# EAGLE schematic boardv1 (EAGLE 7.4.0)
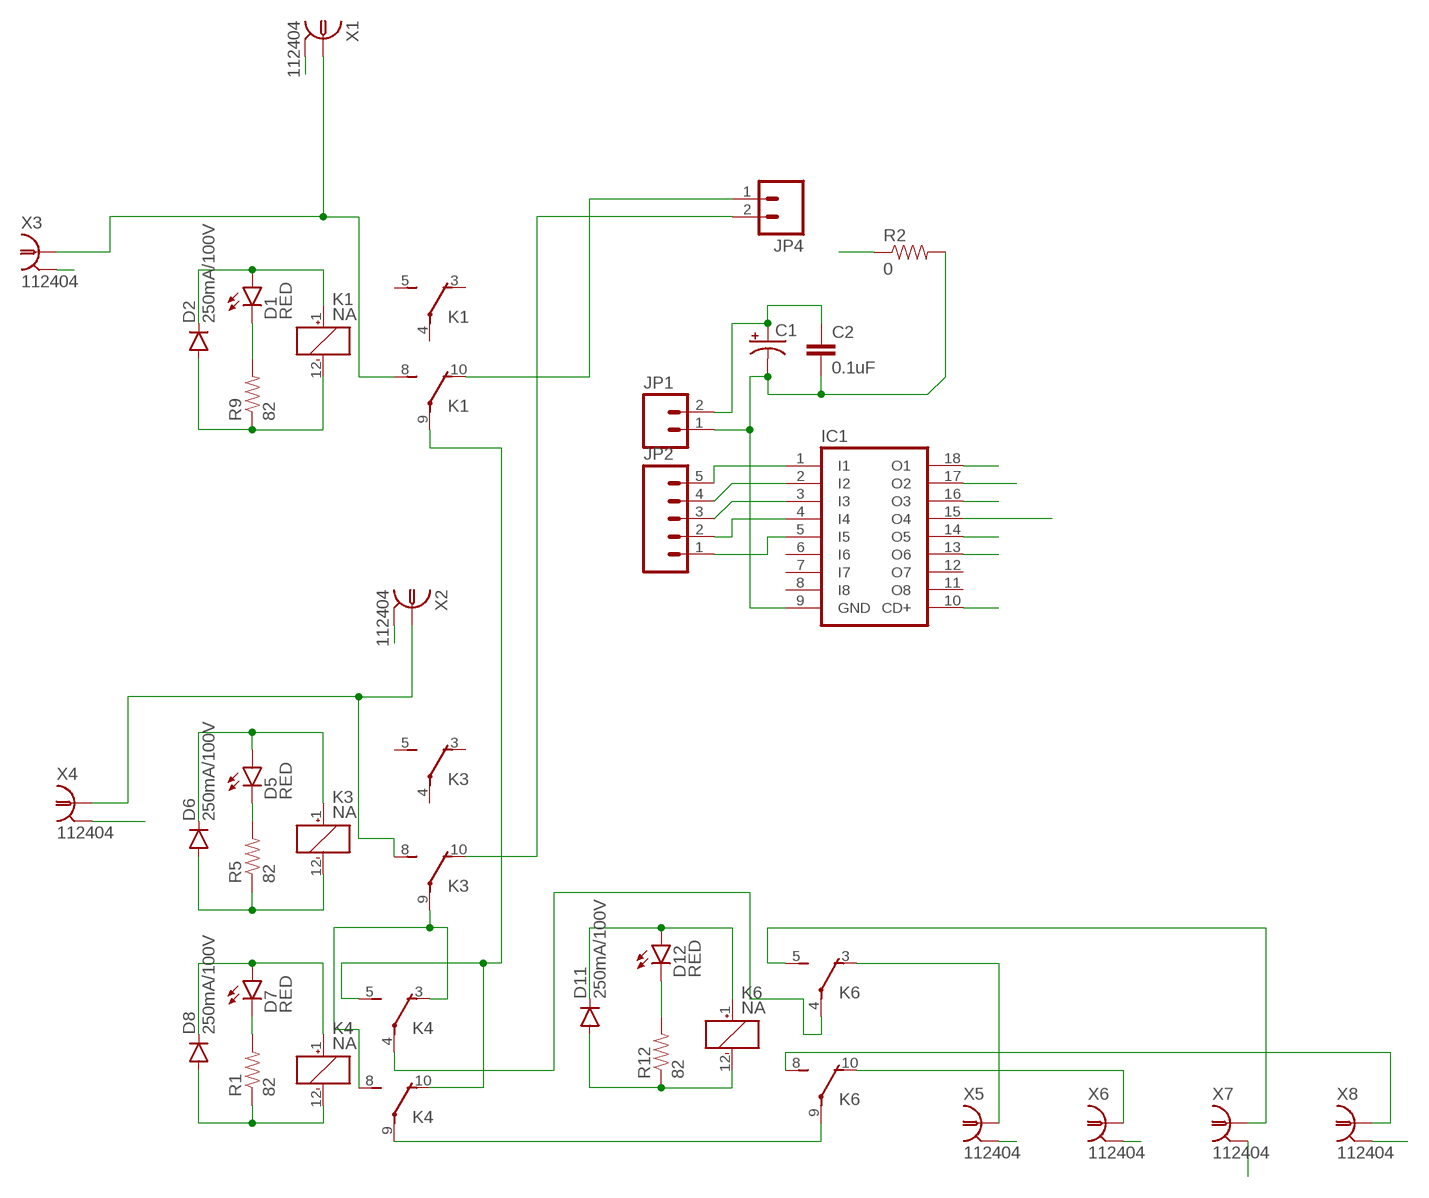
[diagram p0: schematic, sheet 1]

## Parts
C1  100UF-25V-20%(PTH)  [CPOL-RADIAL-100UF-25V]
C2  0.1uF  0.1UF-25V-5%(0603)  [0603-CAP]
D1  RED  LED-RED1206  [LED-1206]
D2  250mA/100V  DIODEBAS16  [SOD-323]
D5  RED  LED-RED1206  [LED-1206]
D6  250mA/100V  DIODEBAS16  [SOD-323]
D7  RED  LED-RED1206  [LED-1206]
D8  250mA/100V  DIODEBAS16  [SOD-323]
D11  250mA/100V  DIODEBAS16  [SOD-323]
D12  RED  LED-RED1206  [LED-1206]
IC1  ULN2803A  [DIL18]
JP1  M02PTH  [1X02]
JP2  M05PTH  [1X05]
JP4  M02PTH  [1X02]
K1  NA  [NA]
K3  NA  [NA]
K4  NA  [NA]
K6  NA  [NA]
R1  82  82OHM-1/10W-1%(0603)SMD  [0603-RES]
R2  0  0OHM-1/10W-5%(0603)  [0603]
R5  82  82OHM-1/10W-1%(0603)SMD  [0603-RES]
R9  82  82OHM-1/10W-1%(0603)SMD  [0603-RES]
R12  82  82OHM-1/10W-1%(0603)SMD  [0603-RES]
X1  112404  [112404]
X2  112404  [112404]
X3  112404  [112404]
X4  112404  [112404]
X5  112404  [112404]
X6  112404  [112404]
X7  112404  [112404]
X8  112404  [112404]

## Nets
ANALOG: K4.9(3:P) K6.9(3:P)
ARDUINO1: JP4.2 K3.10(3:O) K4.3(2:O)
DIGITAL: K4.4(2:P) K6.4(2:P)
GND: R2.1 X1.2 X1.3 X1.4 X1.5 X2.2 X2.3 X2.4 X2.5 X3.2 X3.3 X3.4 X3.5 X4.2 X4.3 X4.4 X4.5 X5.2 X5.3 X5.4 X5.5 X6.2 X6.3 X6.4 X6.5 X7.2 X7.3 X7.4 X7.5 X8.2 X8.3 X8.4 X8.5
GND2: C1.2(-) C2.2 IC1.9(GND) JP1.1 R2.2
N$1: JP4.1 K1.10(3:O)
N$3: D1.C R9.2
N$4: D12.C R12.2
N$5: D5.C R5.2
N$7: D7.C R1.2
N$21: IC1.1(I1) JP2.5
N$22: IC1.2(I2) JP2.4
N$23: IC1.3(I3) JP2.3
N$24: IC1.4(I4) JP2.2
N$25: IC1.5(I5) JP2.1
O1: K1.9(3:P) K4.5(2:S) K4.10(3:O)
O2: K3.8(3:S) X2.1 X4.1
OUTPUT1: K6.3(2:O) X5.1
OUTPUT2: K6.10(3:O) X6.1
OUTPUT4: K6.8(3:S) X8.1
OUTPUTA: K1.8(3:S) X1.1 X3.1
R1: D11.A IC1.18(O1) K6.12(1:-) R12.1
R2: D8.A IC1.17(O2) K4.12(1:-) R1.1
R3: D6.A IC1.16(O3) K3.12(1:-) R5.1
R4: D2.A IC1.15(O4) K1.12(1:-) R9.1
R5: IC1.14(O5)
R6: IC1.13(O6)
SIG3B: K3.9(3:P) K4.8(3:S)
SIG4A: K6.5(2:S) X7.1
VCC: C1.1(+) C2.1 D1.A D2.C D5.A D6.C D7.A D8.C D11.C D12.A IC1.10(CD+) JP1.2 K1.1(1:+) K3.1(1:+) K4.1(1:+) K6.1(1:+)
Unconnected: IC1.6(I6) IC1.7(I7) IC1.8(I8) IC1.11(O8) IC1.12(O7) K1.3(2:O) K1.4(2:P) K1.5(2:S) K3.3(2:O) K3.4(2:P) K3.5(2:S)

## Library data of the parts
C1 = SparkFun-Capacitors:100UF-25V-20%(PTH): CAP-08439; PROD_ID: CAP-08439
C2 = SparkFun-Capacitors:0.1UF-25V-5%(0603): CAP-08604; PROD_ID: CAP-08604
D1 D5 D7 D12 = SparkFun-LED:LED-RED: Assorted Red LEDs LilyPad 1206- DIO-09912 1206- DIO-00809 0603- DIO-00819 "SMART" means more efficient and expensive; PROD_ID: DIO-09912
D2 D6 D8 D11 = SparkFun-DiscreteSemi:DIODE: Diode These are standard reverse protection diodes and small signal diodes. SMA package can handle up to about 1A. SOD-323 can handle about 200mA. What the SOD-323 package when ordering, there are some mfgs out there that are 5-pin packages.; PROD_ID: DIO-09646
IC1 = uln-udn:ULN2803A: DRIVER ARRAY
JP1 JP4 = SparkFun-Connectors:M02: Standard 2-pin 0.1" header. Use with - straight break away headers ( PRT-00116) - right angle break away headers (PRT-00553) - swiss pins (PRT-00743) - machine pins (PRT-00117) - female headers (PRT-00115) Molex polarized connector foot print use with: PRT-08233 with associated crimp pins and housings. 2.54_SCREWTERM for use with PRT-10571. 3.5mm Screw Terminal footprints for PRT-08084 5mm Screw Terminal footprints for use with PRT-08432
JP2 = SparkFun-Connectors:M05: Header 5 Standard 5-pin 0.1" header. Use with straight break away headers (SKU : PRT-00116), right angle break away headers (PRT-00553), swiss pins (PRT-00743), machine pins (PRT-00117), and female headers (PRT-00115). Molex polarized connector foot print use with SKU : PRT-08230 with associated crimp pins and housings.
K1 K3 K4 K6 = relay:NA: RELAY; OC_FARNELL: unknown; OC_NEWARK: unknown
R1 R5 R9 R12 = SparkFun-Resistors:82OHM-1/10W-1%(0603): RES-12311; PROD_ID: RES-12311
R2 = SparkFun-Resistors:0OHM-1/10W-5%(0603): RES-08609; PROD_ID: RES-08609
X1-X8 = amphenol-112404_10:112404: Amphenol Connex 112404 BNC P. C. Mount Recept. Jack Source: http://www.amphenolconnex.com/media/downloads/3157/112404.pdf; MF: Amphenol Connex; MPN: 112404; OC_FARNELL: 1583381; OC_NEWARK: 99H4363